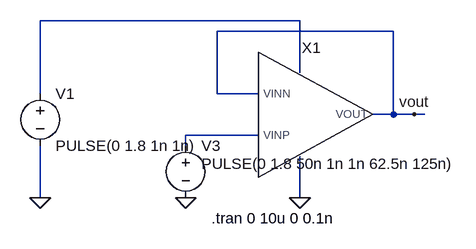
[diagram p0: schematic tb_error_amplifier_tran.asc]
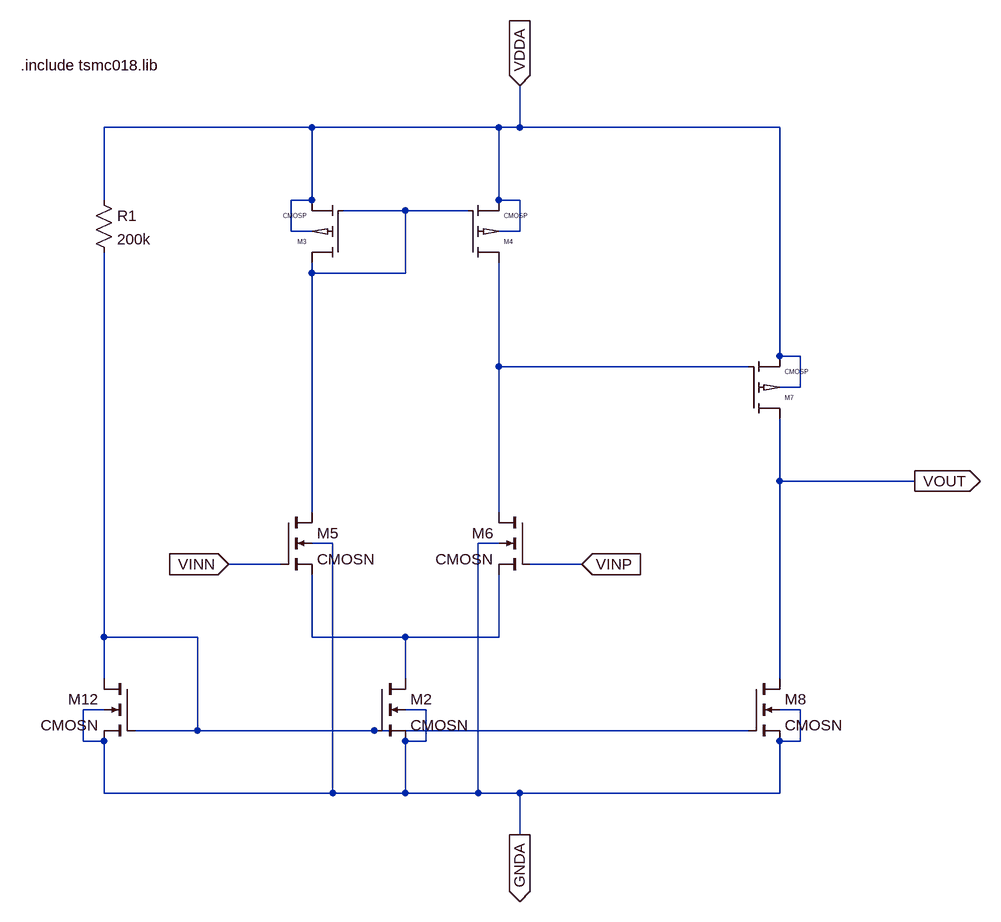
[diagram p1: sub-circuit error_amplifier.asc]
tb_error_amplifier_tran.asc, the LTspice schematic file:
Version 4
SHEET 1 880 680
WIRE 192 16 -208 16
WIRE 336 32 64 32
WIRE 192 96 192 16
WIRE -208 128 -208 16
WIRE 64 128 64 32
WIRE 128 128 64 128
WIRE 336 160 336 32
WIRE 336 160 304 160
WIRE 368 160 336 160
WIRE 384 160 368 160
WIRE 128 192 16 192
WIRE 16 208 16 192
WIRE -208 288 -208 208
WIRE 192 288 192 224
FLAG 192 288 0
FLAG -208 288 0
FLAG 16 288 0
FLAG 368 160 vout
SYMBOL Error_Amplifier 208 176 R0
SYMATTR InstName X1
SYMBOL voltage -208 112 R0
WINDOW 123 0 0 Left 0
SYMATTR InstName V1
SYMATTR Value PULSE(0 1.8 1n 1n)
SYMBOL voltage 16 192 R0
WINDOW 3 24 44 Left 2
WINDOW 123 24 72 Left 2
WINDOW 39 0 0 Left 0
SYMATTR Value PULSE(0 1.8 50n 1n 1n 62.5n 125n)
SYMATTR InstName V3
TEXT 56 320 Left 2 !.tran 0 10u 0 0.1n

error_amplifier.asc, the sub-circuit schematic file:
Version 4
SHEET 1 2700 752
WIRE -384 -1360 -704 -1360
WIRE -96 -1360 -384 -1360
WIRE -64 -1360 -64 -1424
WIRE -64 -1360 -96 -1360
WIRE 336 -1360 -64 -1360
WIRE -704 -1248 -704 -1360
WIRE -384 -1248 -384 -1360
WIRE -384 -1248 -416 -1248
WIRE -96 -1248 -96 -1360
WIRE -64 -1248 -96 -1248
WIRE -240 -1232 -336 -1232
WIRE -144 -1232 -240 -1232
WIRE -416 -1200 -416 -1248
WIRE -384 -1200 -416 -1200
WIRE -64 -1200 -64 -1248
WIRE -64 -1200 -96 -1200
WIRE -384 -1136 -384 -1152
WIRE -240 -1136 -240 -1232
WIRE -240 -1136 -384 -1136
WIRE 336 -1008 336 -1360
WIRE 368 -1008 336 -1008
WIRE -96 -992 -96 -1152
WIRE 288 -992 -96 -992
WIRE 368 -960 368 -1008
WIRE 368 -960 336 -960
WIRE 336 -816 336 -912
WIRE 544 -816 336 -816
WIRE -384 -768 -384 -1136
WIRE -96 -768 -96 -992
WIRE -352 -720 -384 -720
WIRE -96 -720 -128 -720
WIRE -432 -688 -512 -688
WIRE 32 -688 -48 -688
WIRE -704 -576 -704 -1168
WIRE -560 -576 -704 -576
WIRE -384 -576 -384 -672
WIRE -240 -576 -384 -576
WIRE -96 -576 -96 -672
WIRE -96 -576 -240 -576
WIRE -704 -512 -704 -576
WIRE -240 -512 -240 -576
WIRE 336 -512 336 -816
WIRE -704 -464 -736 -464
WIRE -208 -464 -240 -464
WIRE 368 -464 336 -464
WIRE -560 -432 -560 -576
WIRE -560 -432 -656 -432
WIRE -288 -432 -560 -432
WIRE 288 -432 -288 -432
WIRE -736 -416 -736 -464
WIRE -704 -416 -736 -416
WIRE -208 -416 -208 -464
WIRE -208 -416 -240 -416
WIRE 368 -416 368 -464
WIRE 368 -416 336 -416
WIRE -704 -336 -704 -416
WIRE -352 -336 -352 -720
WIRE -352 -336 -704 -336
WIRE -240 -336 -240 -416
WIRE -240 -336 -352 -336
WIRE -128 -336 -128 -720
WIRE -128 -336 -240 -336
WIRE -64 -336 -128 -336
WIRE 336 -336 336 -416
WIRE 336 -336 -64 -336
WIRE -64 -272 -64 -336
FLAG -64 -1424 VDDA
IOPIN -64 -1424 In
FLAG -64 -272 GNDA
IOPIN -64 -272 Out
FLAG 544 -816 VOUT
IOPIN 544 -816 Out
FLAG -512 -688 VINN
IOPIN -512 -688 In
FLAG 32 -688 VINP
IOPIN 32 -688 In
SYMBOL cmosn -656 -512 M0
SYMATTR InstName M12
SYMATTR Value2 l=180n w=1u
SYMBOL cmosn -288 -512 R0
SYMATTR InstName M2
SYMATTR Value2 l=180n w=5u
SYMBOL cmosp -336 -1152 R180
SYMATTR InstName M3
SYMATTR Value2 l=360n w=3u
SYMBOL cmosp -144 -1152 M180
SYMATTR InstName M4
SYMATTR Value2 l=360n w=3u
SYMBOL cmosn -432 -768 R0
SYMATTR InstName M5
SYMATTR Value2 l=360n w=10u
SYMBOL cmosn -48 -768 M0
SYMATTR InstName M6
SYMATTR Value2 l=360n w=10u
SYMBOL cmosp 288 -912 M180
SYMATTR InstName M7
SYMATTR Value2 l=180n w=5u
SYMBOL cmosn 288 -512 R0
SYMATTR InstName M8
SYMATTR Value2 l=180n w=1u
SYMBOL res -720 -1264 R0
SYMATTR InstName R1
SYMATTR Value 200k
TEXT -832 -1456 Left 2 !.include tsmc018.lib

The netlist it stands for:
* tb_error_amplifier_tran.asc
XX1 N001 vout N002 0 vout error_amplifier
V1 N001 0 PULSE(0 1.8 1n 1n)
V3 N002 0 PULSE(0 1.8 50n 1n 1n 62.5n 125n)

* block symbol definitions
.subckt error_amplifier VDDA VINN VINP GNDA VOUT
M12 N003 N003 GNDA GNDA CMOSN l=180n w=1u
M2 N004 N003 GNDA GNDA CMOSN l=180n w=5u
M3 N001 N001 VDDA VDDA CMOSP l=360n w=3u
M4 N002 N001 VDDA VDDA CMOSP l=360n w=3u
M5 N001 VINN N004 GNDA CMOSN l=360n w=10u
M6 N002 VINP N004 GNDA CMOSN l=360n w=10u
M7 VOUT N002 VDDA VDDA CMOSP l=180n w=5u
M8 VOUT N003 GNDA GNDA CMOSN l=180n w=1u
R1 VDDA N003 200k
.include tsmc018.lib
.ends error_amplifier

.model NMOS NMOS
.model PMOS PMOS
.lib standard.mos
.tran 0 10u 0 0.1n
.lib tsmc018.lib
.backanno
.end